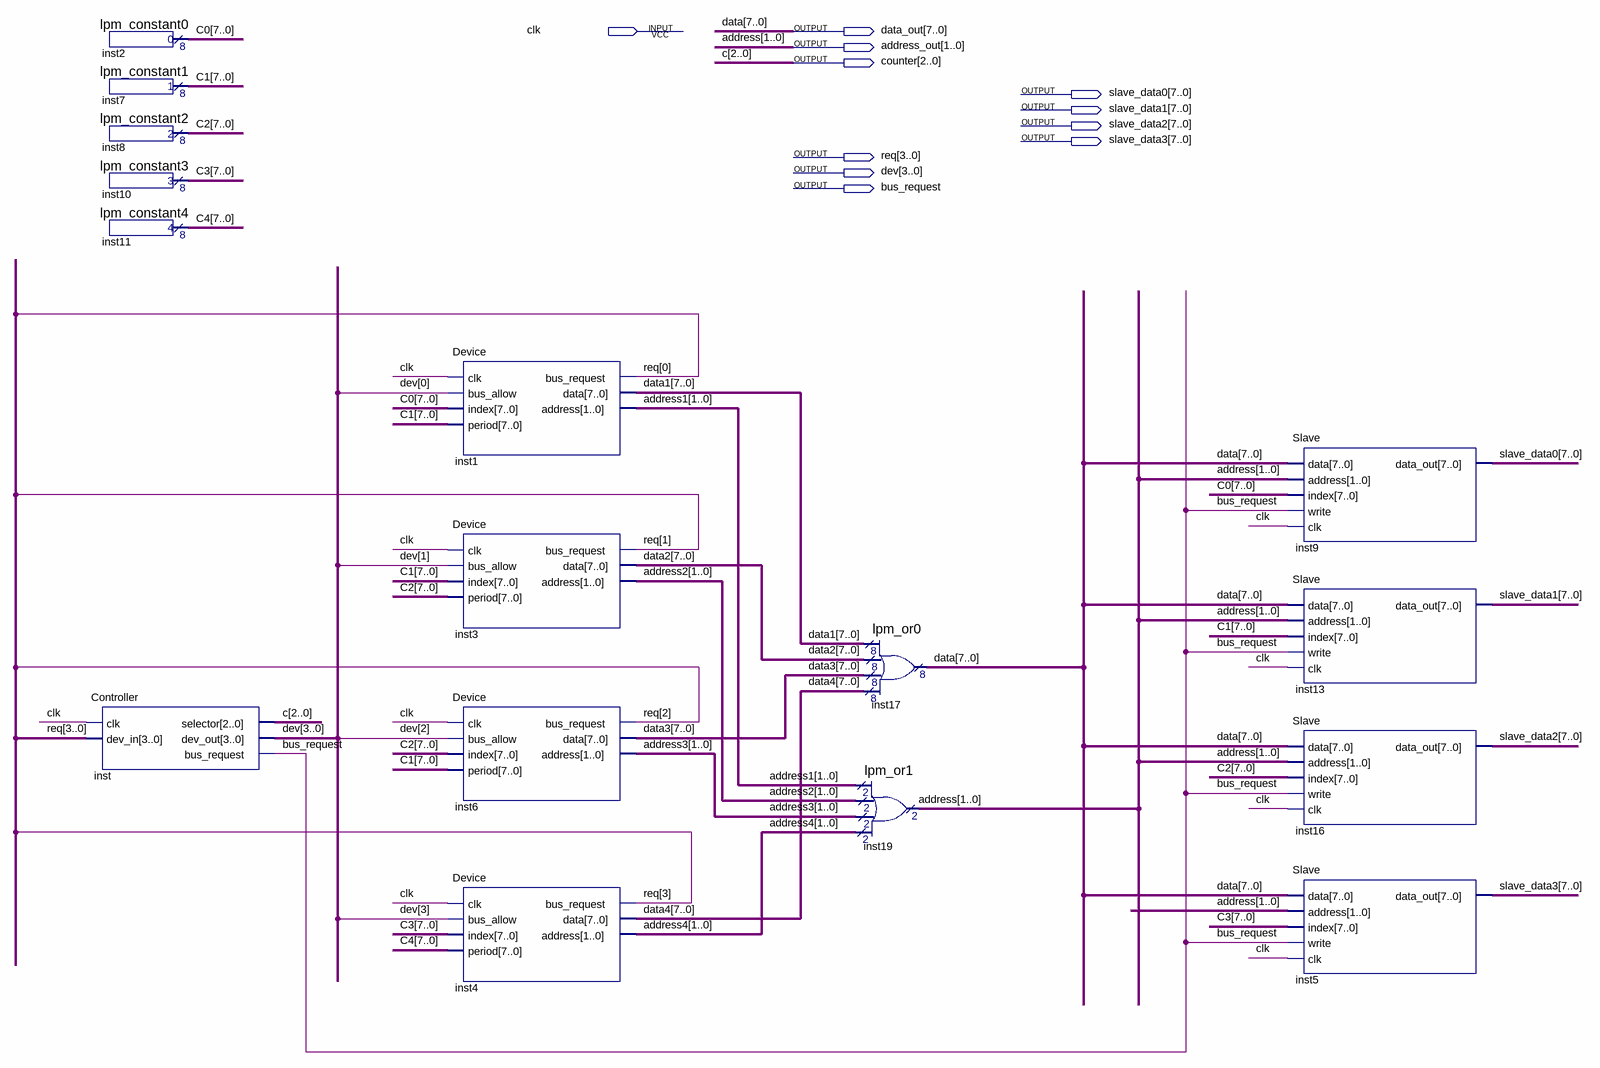
[diagram p0: schematic sheet]
// Quartus schematic Main.bdf as structural Verilog: 16 symbols, 11 pins
module Main (
  input  clk,
  output [7:0] data_out,
  output [1:0] address_out,
  output [2:0] counter,
  output [7:0] slave_data0,
  output [7:0] slave_data1,
  output [7:0] slave_data2,
  output [7:0] slave_data3,
  output [3:0] req,
  output [3:0] dev,
  output bus_request
);

  wire [1:0] address1, address2, address3, address4;
  wire [7:0] C0, C1, C2, C3, C4, data1, data2, data3, data4;

  lpm_constant0 inst2 (.result(C0));
  lpm_constant1 inst7 (.result(C1));
  lpm_constant2 inst8 (.result(C2));
  lpm_constant3 inst10 (.result(C3));
  lpm_constant4 inst11 (.result(C4));
  Controller inst (.clk(clk), .dev_in(req), .selector(counter), .dev_out(dev), .bus_request(bus_request));
  Device inst1 (
    .clk(clk), .bus_allow(dev[0]), .index(C0), .period(C1), .bus_request(req[0]), .data(data1),
    .address(address1));
  Device inst3 (
    .clk(clk), .bus_allow(dev[1]), .index(C1), .period(C2), .bus_request(req[1]), .data(data2),
    .address(address2));
  Device inst6 (
    .clk(clk), .bus_allow(dev[2]), .index(C2), .period(C1), .bus_request(req[2]), .data(data3),
    .address(address3));
  Device inst4 (
    .clk(clk), .bus_allow(dev[3]), .index(C3), .period(C4), .bus_request(req[3]), .data(data4),
    .address(address4));
  lpm_or0 inst17 (.data0x(data1), .data1x(data2), .data2x(data3), .data3x(data4), .result(data_out));
  lpm_or1 inst19 (.data0x(address1), .data1x(address2), .data2x(address3), .data3x(address4), .result(address_out));
  Slave inst9 (
    .data(data_out), .address(address_out), .index(C0), .write(bus_request), .clk(clk), .data_out(slave_data0));
  Slave inst13 (
    .data(data_out), .address(address_out), .index(C1), .write(bus_request), .clk(clk), .data_out(slave_data1));
  Slave inst16 (
    .data(data_out), .address(address_out), .index(C2), .write(bus_request), .clk(clk), .data_out(slave_data2));
  Slave inst5 (
    .data(data_out), .address(address_out), .index(C3), .write(bus_request), .clk(clk), .data_out(slave_data3));

  // Other names for the same wires on the sheet: address[1:0] = address_out; c[2:0] = counter; data[7:0] = data_out
endmodule
